# EasyEDA Pro project RS232转接控制板.eprj

# Schematic 原理图
Board Name: 转接隔离板; Create Date: 2024-04-22; Page Name: 主控MCU; Project Name: RS232转接控制板; Schematic Name: 原理图; Update Date: 2025-11-13; Company: 嘉立创EDA; Page Size: A3; Version: V1.0
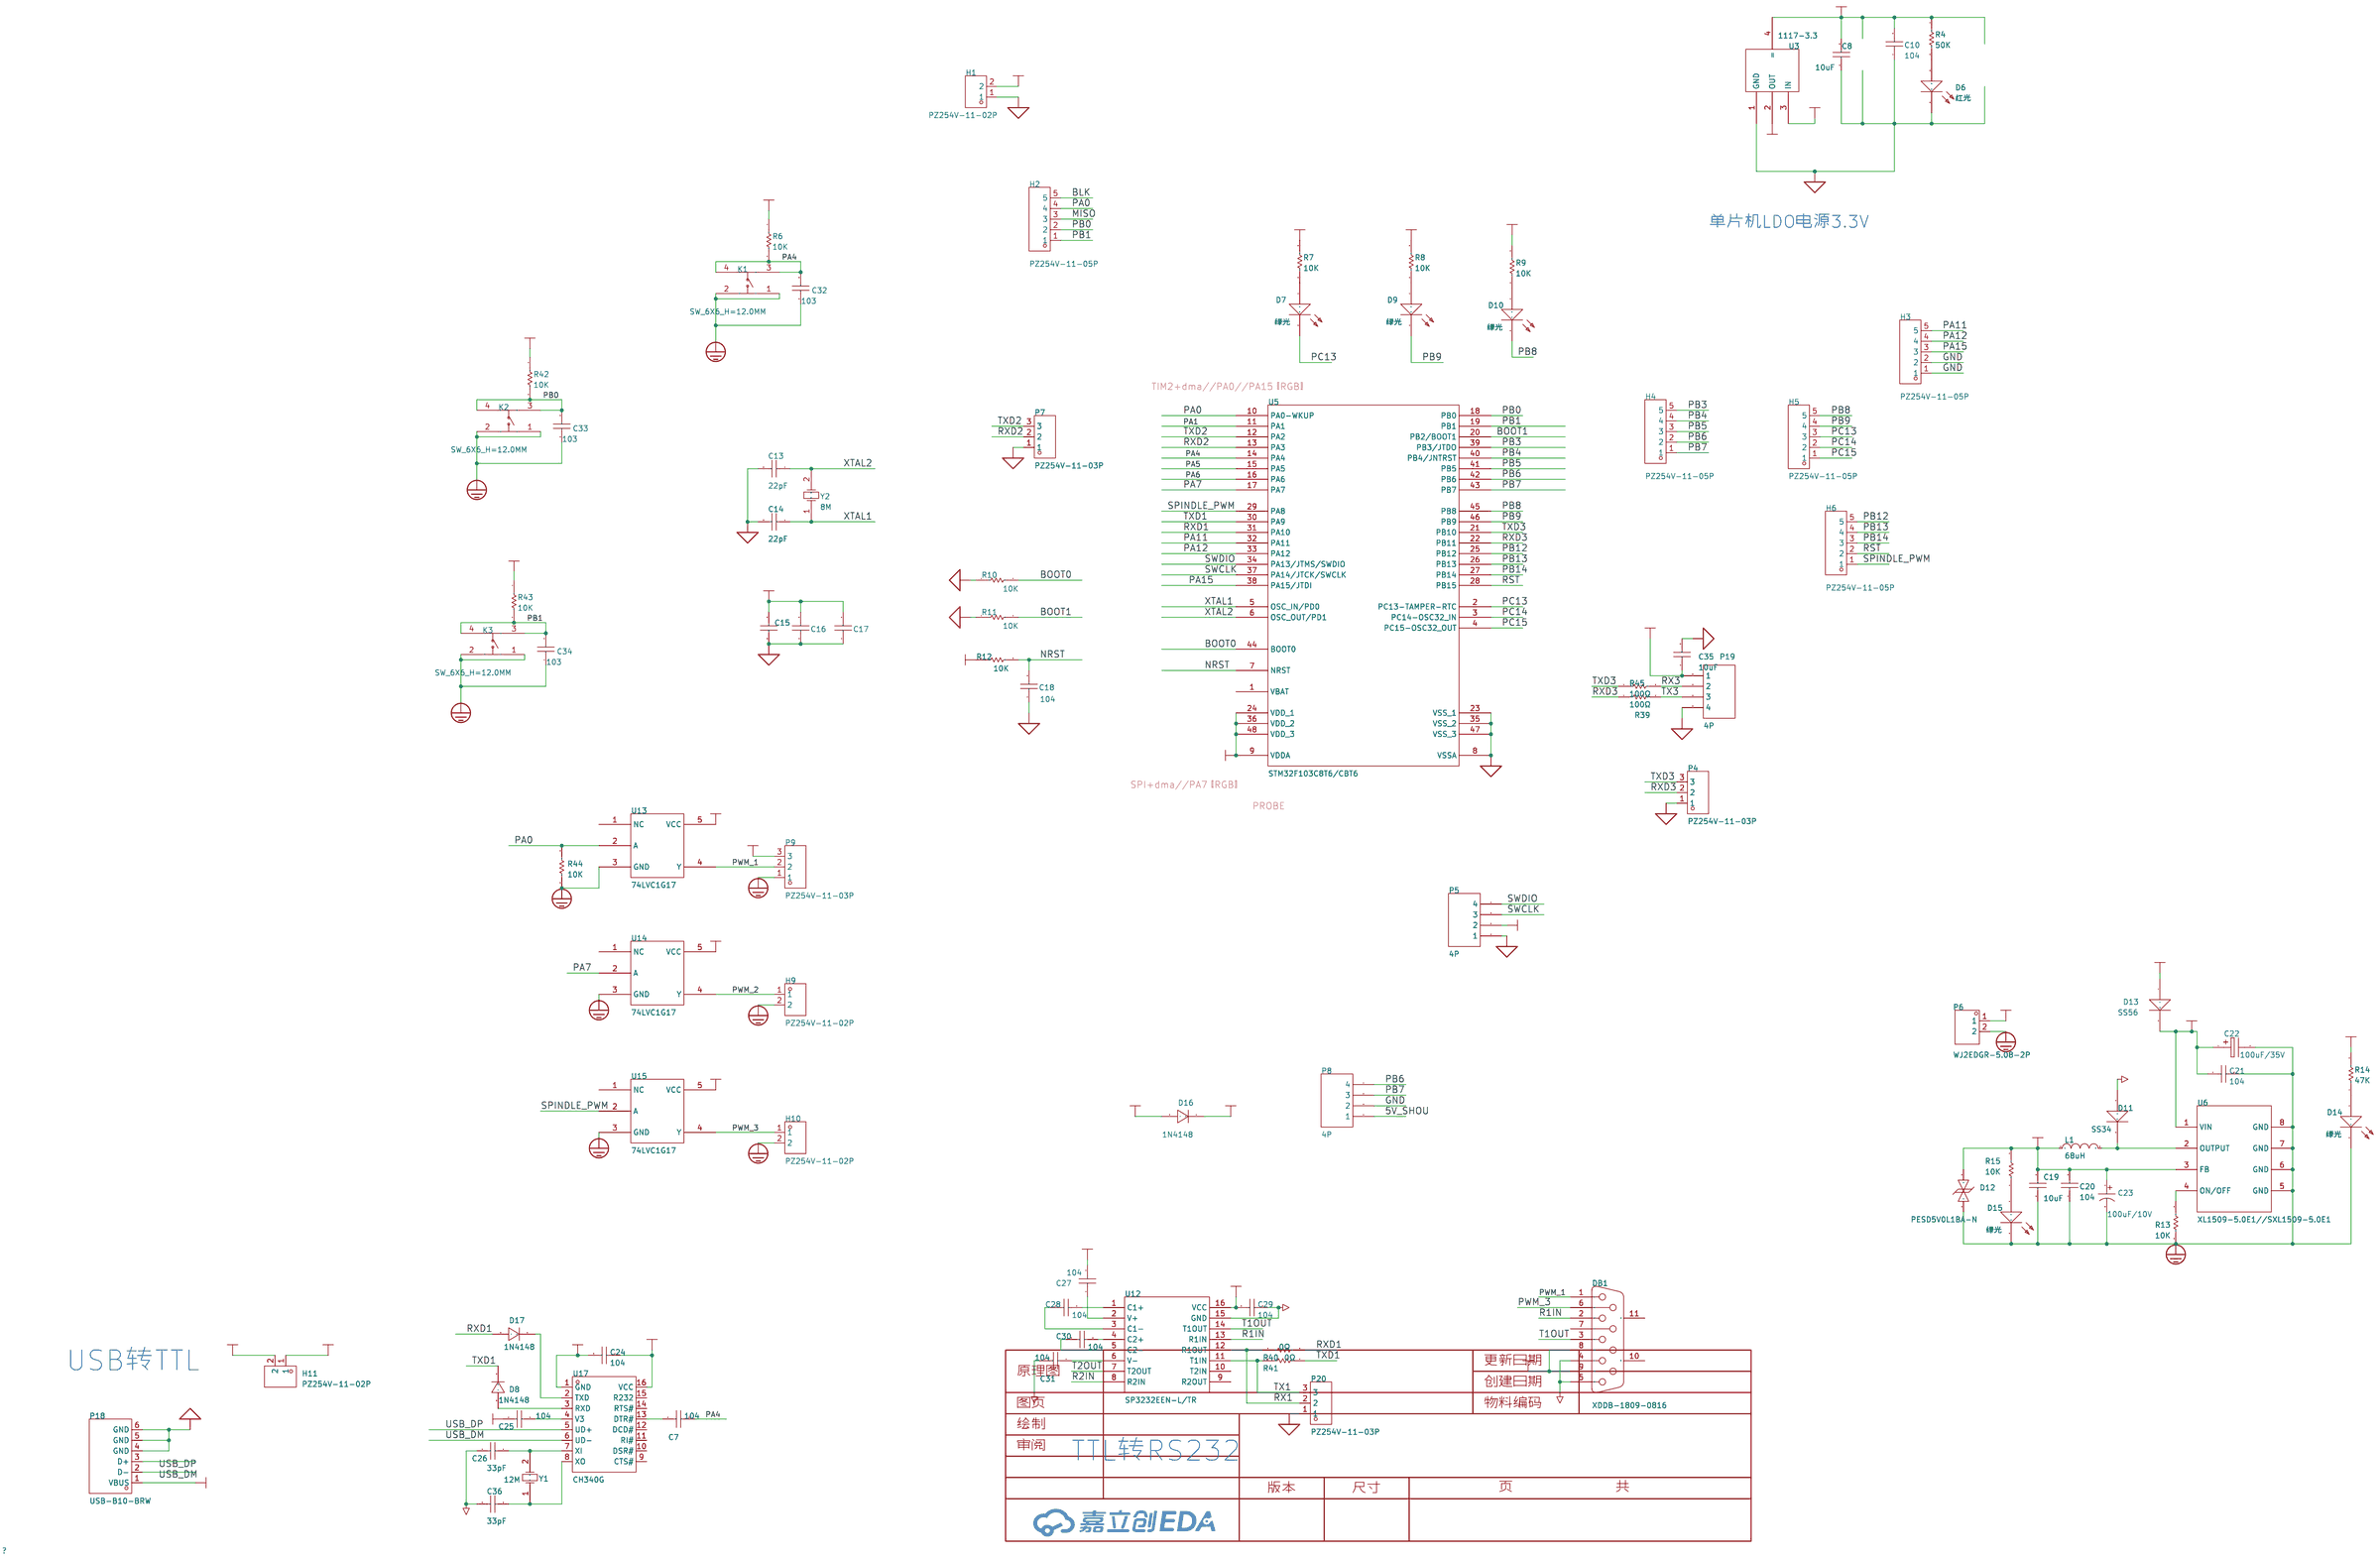
[diagram p0: schematic sheet]

## Parts
C7  104  [0603C]
C8  10uF  [C1206]
C10  104  [0603C]
C13  100pF  [0603C]
C14  100pF  [0603C]
C15  104  [0603C]
C16  104  [0603C]
C17  104  [0603C]
C18  104  [0603C]
C19  10uF  [C1206]
C20  104  [0603C]
C21  104  [0603C]
C22  100uF/35V  [电解电容贴片6X6]
C23  100uF/10V  [CAP-SMD_BD5.0-L5.3-W5.3-RD]
C24  104  [0603C]
C25  104  [0603C]
C26  18pF  [0603C]
C27  104  [0603C]
C28  104  [0603C]
C29  104  [0603C]
C30  104  [0603C]
C31  104  [0603C]
C32  103  [11]
C33  103  [11]
C34  103  [11]
C35  10uF  [C1206]
C36  18pF  [0603C]
D6  红光  [0603LED]
D7  绿光  [0603LED]
D8  1N4148  [SOD-123_L2.8-W1.8-LS3.7-RD]
D9  绿光  [0603LED]
D10  绿光  [0603LED]
D11  SS34  [SMA]
D12  PESD5V0L1BA-N  [SOD-323_L1.8-W1.3-LS2.5-BI]
D13  SS56  [SMA]
D14  绿光  [0603LED]
D15  绿光  [0603LED]
D16  1N4148  [SOD-123_L2.8-W1.8-LS3.7-RD]
D17  1N4148  [SOD-123_L2.8-W1.8-LS3.7-RD]
DB1  XDDB-1809-0816  [DB9-TH_LD09P33E4GV00LF]
H1  PZ254V-11-02P  [HDR-TH_2P-P2.54-V-M]
H2  PZ254V-11-05P  [HDR-TH_5P-P2.54-V-M]
H3  PZ254V-11-05P  [HDR-TH_5P-P2.54-V-M]
H4  PZ254V-11-05P  [HDR-TH_5P-P2.54-V-M]
H5  PZ254V-11-05P  [HDR-TH_5P-P2.54-V-M]
H6  PZ254V-11-05P  [HDR-TH_5P-P2.54-V-M]
H9  PZ254V-11-02P  [HDR-TH_2P-P2.54-V-M]
H10  PZ254V-11-02P  [HDR-TH_2P-P2.54-V-M]
H11  PZ254V-11-02P  [HDR-TH_2P-P2.54-V-M]
K1  SW_6X6_H=12.0MM  [KEY-SMD_4P-L6.0-W6.0-P4.50-LS9.0]
K2  SW_6X6_H=12.0MM  [KEY-SMD_4P-L6.0-W6.0-P4.50-LS9.0]
K3  SW_6X6_H=12.0MM  [KEY-SMD_4P-L6.0-W6.0-P4.50-LS9.0]
L1  68uH  [IND-SMD_L7.0-W7.0_SMDRI74-330MT]
P4  PZ254V-11-03P  [HDR-TH_3P-P2.54-V-M]
P5  4P  [SIP4]
P6  WJ2EDGR-5.08-2P  [CONN-TH_WJ2EDGR-5.08-2P]
P7  PZ254V-11-03P  [HDR-TH_3P-P2.54-V-M]
P8  4P  [SIP4]
P9  PZ254V-11-03P  [HDR-TH_3P-P2.54-V-M]
P18  USB-B10-BRW  [USB-B-TH_USB-B10-BRW]
P19  4P  [HDR1X4_CON]
P20  PZ254V-11-03P  [HDR-TH_3P-P2.54-V-M]
R4  50K  [0603R]
R6  10K  [0603R]
R7  10K  [0603R]
R8  10K  [0603R]
R9  10K  [0603R]
R10  10K  [0603R]
R11  10K  [0603R]
R12  10K  [0603R]
R13  10K  [0603R]
R14  47K  [0603R]
R15  10K  [0603R]
R39  100Ω  [0603R]
R40  0Ω  [0603R]
R41  0Ω  [0603R]
R42  10K  [0603R]
R43  10K  [0603R]
R44  10K  [0603R]
R45  100Ω  [0603R]
U3  1117-3.3  [SOT-223]
U5  STM32F103C8T6/CBT6  [LQFP48]
U6  XL1509-5.0E1//SXL1509-5.0E1  [ESOP-8_L4.9-W3.9-P1.27-LS6.0-BL-EP]
U12  SP3232EEN-L/TR  [SOIC-16_L9.9-W3.9-P1.27-LS6.0-BL]
U13  74LVC1G17  [SOT-23-5]
U14  74LVC1G17  [SOT-23-5]
U15  74LVC1G17  [SOT-23-5]
U17  CH340G  [SOIC-16_L9.9-W3.9-P1.27-LS6.0-BL]
Y1  12M  [晶振贴片49SSMD]
Y2  8M  [晶振贴片]

## Library data of the parts
C7 C18 C25 = 104: Capacitor (Semiconductor SIM Model); Published: 8-Jun-2000; LatestRevisionDate: 17-Jul-2002; LatestRevisionNote: Re-released for DXP Platform.; PackageReference: C1206; Publisher: Altium Limited; Origin Footprint 2: C1206; Origin Footprint 3: 0402; Origin Footprint 4: 1310[0504]; Origin Footprint 5: 1608[0603]; Origin Footprint 6: C1210; Origin Footprint 7: C0805; Origin Footprint 8: C1206; Origin Footprint 9: 0805; Origin Footprint 10: 0805L; Origin Footprint 11: 0805C; Design Item ID: Cap Semi; Library Name: Miscellaneous Devices
C8 C19 C35 = 104: Design Item ID: CAP; Library Name: SCH--װ--
C10 C20 C21 = 104: Capacitor (Semiconductor SIM Model); Published: 8-Jun-2000; LatestRevisionDate: 17-Jul-2002; LatestRevisionNote: Re-released for DXP Platform.; PackageReference: C1206; Publisher: Altium Limited; Origin Footprint 2: C1206; Origin Footprint 3: 0402; Origin Footprint 4: 1310[0504]; Origin Footprint 5: 1608[0603]; Origin Footprint 6: C1210; Origin Footprint 7: C0805; Origin Footprint 8: C1206; Origin Footprint 9: 0805; Origin Footprint 10: 0805L; Design Item ID: Cap Semi; Library Name: Miscellaneous Devices
C13 C14 = 22pF: Capacitor (Semiconductor SIM Model); Published: 8-Jun-2000; LatestRevisionDate: 17-Jul-2002; LatestRevisionNote: Re-released for DXP Platform.; PackageReference: C1206; Publisher: Altium Limited; Origin Footprint 2: C1206; Origin Footprint 3: 0402; Origin Footprint 4: 1310[0504]; Origin Footprint 5: 1608[0603]; Origin Footprint 6: C1210; Origin Footprint 7: C0805; Origin Footprint 8: C1206; Origin Footprint 9: 0805; Origin Footprint 10: 0805L; Origin Footprint 11: 0805C; Design Item ID: Cap Semi; Library Name: Miscellaneous Devices
C15-C17 = 104: Origin Footprint 2: CAP; Origin Footprint 3: 0805C; Design Item ID: CAP; Library Name: SCH封装库
C22 = 100uF/35V: Origin Footprint 2: X47U; Origin Footprint 1: 电解电容贴片6x6; Design Item ID: ELECTRO1; Library Name: *
C23 = CS1A101M-CRD54: 容值:100uF;精度:±20%;额定电压:10V;电容体直径:5mm;电容体长度:5.4mm;纹波电流:-;等效串联电阻:-;工作寿命:1000hrs@105℃;工作温度:-40℃~+105℃;; LCSC Part Name: 100uF ±20% 10V; Supplier Part: C96182; Manufacturer: ST(先科); Supplier Footprint: SMD,5x5.4mm; JLCPCB Part Class: Extended Part; Datasheet: https://atta.szlcsc.com/upload/public/pdf/source/20170304/1488621207726.pdf; Supplier: LCSC; Tolerance: ±20%; Rated Voltage: 10V; φD: 5mm; L: 5.4mm; Lifetime @ Temp: 1000hrs@105℃; Operating Temperature: -40℃~+105℃
C24 C27-C31 = 103: Capacitor (Semiconductor SIM Model); Published: 8-Jun-2000; LatestRevisionDate: 17-Jul-2002; LatestRevisionNote: Re-released for DXP Platform.; PackageReference: C1206; Publisher: Altium Limited; Origin Footprint 2: C1206; Origin Footprint 3: 0402; Origin Footprint 4: 1310[0504]; Origin Footprint 5: 1608[0603]; Origin Footprint 6: C1210; Origin Footprint 7: C0805; Origin Footprint 8: C1206; Origin Footprint 9: 0805; Origin Footprint 10: 0805L; Design Item ID: Cap Semi; Library Name: Miscellaneous Devices
C26 C36 = 33pF: Capacitor (Semiconductor SIM Model); Published: 8-Jun-2000; LatestRevisionDate: 17-Jul-2002; LatestRevisionNote: Re-released for DXP Platform.; PackageReference: C1206; Publisher: Altium Limited; Origin Footprint 2: C1206; Origin Footprint 3: 0402; Origin Footprint 4: 1310[0504]; Origin Footprint 5: 1608[0603]; Origin Footprint 6: C1210; Origin Footprint 7: C0805; Origin Footprint 8: C1206; Origin Footprint 9: 0805; Origin Footprint 10: 0805L; Design Item ID: Cap Semi; Library Name: Miscellaneous Devices
C32-C34 = 103: Design Item ID: CAP; Library Name: SCH封装库
D6 = 红光: Origin Footprint 2: LED(小); Design Item ID: LED; Library Name: SCH封装库
D7 D9 D10 D14 D15 = 绿光: Origin Footprint 2: LED(小); Design Item ID: LED; Library Name: SCH封装库
D8 D16 D17 = 1N4148W-TP: 二极管配置:-;功率:400mW;直流反向耐压(Vr):100V;平均整流电流(Io):150mA;正向压降(Vf):1.25V@150mA;反向电流(Ir):1μA@75V;反向恢复时间(trr):4ns;工作温度:-65℃~+150℃@(Tj);; LCSC Part Name: 100V 150mA 4ns; Supplier Part: C77978; Manufacturer: MCC(美微科); Supplier Footprint: SOD-123; JLCPCB Part Class: Extended Part; Datasheet: https://atta.szlcsc.com/upload/public/pdf/source/20161112/1478931639357.pdf; Supplier: LCSC; Power Dissipation: 400mW; Reverse Voltage (Vr): 100V; Average Rectified Current (Io): 150mA; Forward Voltage (Vf@If): 1.25V@150mA; Reverse Leakage Current: 1μA@75V; Reverse Recovery Time (trr): 4ns; Operating Temperature: -65℃~+150℃@(Tj)
D11 = SS56: Design Item ID: 1N4148; Library Name: SCH--װ--
D12 = PESD5V0S1BBN: 极性:Bidirectional;反向关断电压（典型值）:5V (Max);击穿电压（最小值）:6V;箝位电压:15V;峰值脉冲电流（10/1000us）:5A (8/20us);; Supplier Part: C314264; Manufacturer: BORN伯恩半导体; Supplier Footprint: SOD-523; JLCPCB Part Class: Extended Part; Datasheet: https://atta.szlcsc.com/upload/public/pdf/source/20181015/C314264_F9AC5761AC2631DA841FBD1D9C6821E3.pdf; Supplier: LCSC; Polarity: Bidirectional; Voltage - Reverse Standoff (Typ): 5V (Max); Voltage - Breakdown (Min): 6V; Voltage - Clamping (Max) @ Ipp: 15V; Current - Peak Pulse (10/1000μs): 5A (8/20us)
D13 = SS56: Design Item ID: 1N4148; Library Name: SCH封装库
DB1 = XDDB-1809-0816: 连接器类型:常规D-Sub;公母:公;总PIN位数:9P;安装方式:弯插;排数:2;额定电流-信号脚:3A;工作温度范围:-40℃~+85℃;; LCSC Part Name: D-Sub 公 P数:9P; Supplier Part: C7498157; Manufacturer: LX(连欣科技); Supplier Footprint: 插件; JLCPCB Part Class: 扩展库; Datasheet: https://atta.szlcsc.com/upload/public/pdf/source/20230825/11AC0D8BC28315CABA4F65E63009CD5C.pdf; Supplier: LCSC; Connector Type: 常规D-Sub; Gender: 公; Number of Pins: 9P; Mounting Style: 弯插; Number of Rows: 2; Current Rating-Signal (Max): 3A; Rated Voltage (Max): 100V; Operating Temperature Range: -40℃~+85℃
H1 H9-H11 = PZ254V-11-02P: 插针结构:1x2P;间距:2.54mm;行距:-;圆针/方针:方针;安装类型:直插;排数:单排;总PIN位数:2P;额定电流:-;额定电压:-;配合针长度:6mm;塑高:2.5mm;端接针长度:3mm;触头材质:黄铜;触头镀层:-;工作温度范围:-40℃~+105℃;颜色:黑色;; LCSC Part Name: 间距:2.54mm 1x2P 直插 方针; Supplier Part: C492401; Manufacturer: XFCN(兴飞); Supplier Footprint: 插件,P=2.54mm; JLCPCB Part Class: 扩展库; Datasheet: https://atta.szlcsc.com/upload/public/pdf/source/20200309/C492401_A812433581A9B211A7FFA413ADDFF0E5.pdf; Supplier: LCSC; Pin Structure: 1x2P; Pitch: 2.54mm; Circluar Pins/Square Pins: 方针; Mounting Type: 直插; Number of Rows: 单排; Number of Pins: 2P; Length of Mating Pin: 6mm; Insulation Height: 2.5mm; Length of End Connection Pin: 3mm; Contact Material: 黄铜; Operating Temperature Range: -40℃~+105℃; Color: 黑色
H2-H6 = PZ254V-11-05P: LCSC Part Name: 2.54mm 1x5P 直插 方针; Supplier Part: C492404; Manufacturer: XFCN(兴飞); Supplier Footprint: 直插,P=2.54mm; JLCPCB Part Class: Extended Part; Datasheet: https://atta.szlcsc.com/upload/public/pdf/source/20200309/C492404_E51533260F8710EFF5D4617281164C1D.pdf; Supplier: LCSC; Pitch: 2.54mm; Number of Pins: 5; Number of Rows: 1; Pin Structure: 1x5P; Mounting Type: 直插; Circluar Pins/Square Pins: 方针; Length of Mating Pin: 6mm; Insulation Height: 2.5mm; Length of End Connection Pin: 3mm; Contact Material: 黄铜; Operating Temperature Range: -40℃~+105℃; Color: 黑色
K1-K3 = SW_6X6_H=12.0MM: Supplier Part: C9900018802; Supplier Footprint: KEY-SMD; JLCPCB Part Class: 扩展库; Supplier: LCSC
L1 = SMDRI74-330MT: 电感值:33uH;精度:±20%;额定电流:960mA;饱和电流(Isat):1.8A;类型:屏蔽电感;; LCSC Part Name: 33uH±20%1.8A; Supplier Part: C49625; Manufacturer: SXN(顺翔诺); Supplier Footprint: SMD,7.5x7.5mm; JLCPCB Part Class: 扩展库; Datasheet: https://atta.szlcsc.com/upload/public/pdf/source/20210810/6F96FDC19AA308DD2AD166FFB9640E87.pdf; Supplier: LCSC; Tolerance: ±20%; Rated Current: 960mA; Saturation Current (Isat): 1.8A; DC Resistance (DCR): 170mΩ; Type: 屏蔽电感
P4 P7 P9 P20 = PZ254V-11-03P: 插针结构:1x3P;间距:2.54mm;行距:-;圆针/方针:方针;安装类型:直插;排数:单排;总PIN位数:3P;额定电流:3A;额定电压:250V;配合针长度:6mm;塑高:2.5mm;端接针长度:3mm;工作温度范围:-40℃~+105℃;颜色:黑色;; LCSC Part Name: 间距:2.54mm 1x3P 直插 方针; Supplier Part: C2937625; Manufacturer: XFCN(兴飞); Supplier Footprint: 插件,P=2.54mm; JLCPCB Part Class: 扩展库; Datasheet: https://atta.szlcsc.com/upload/public/pdf/source/20200309/C492402_8335C3D49C4E4C618838D59BB1D024C1.pdf; Supplier: LCSC; Pin Structure: 1x3P; Pitch: 2.54mm; Circluar Pins/Square Pins: 方针; Mounting Type: 直插; Number of Rows: 单排; Number of Pins: 3P; Current Rating (Max): 3A; Voltage Rating (Max): 250V; Length of Mating Pin: 6mm; Insulation Height: 2.5mm; Length of End Connection Pin: 3mm; Operating Temperature Range: -40℃~+105℃; Color: 黑色
P5 P8 = 4P: Library Name: SCH--װ--
P6 = WJ2EDGR-5.08-2P: 每排PIN数:2;安装方式:弯针;排数:1;间距:5.08mm;连接器类型:板端/插座-开口;; LCSC Part Name: 插针/板端 弯针 2P 5.08mm; Supplier Part: C8383; Manufacturer: KANGNEX(康奈克斯电气); Supplier Footprint: P=5.08mm; JLCPCB Part Class: Extended Part; Datasheet: https://atta.szlcsc.com/upload/public/pdf/source/20191225/C8383_DE80ABD4B75356B45B295FA186A21D08.pdf; Supplier: LCSC; Number of PINs Per Row: 2; Mounting Sytle: 弯针; Number of Rows: 1; Pitch: 5.08mm; Connector Type: 板端/插座-开口
P18 = USB-B10-BRW: 连接器类型:Type-B;标准:USB 2.0;公母:母;端口数量:1;触点数量:4P;安装方式:弯插;额定电流 - 电源:1.5A;工作温度范围:-20℃~+70℃;焊接温度(最大值):260℃;; LCSC Part Name: Type-B母弯插; Supplier Part: C720549; Manufacturer: XUNPU(讯普); Supplier Footprint: 插件; JLCPCB Part Class: 扩展库; Datasheet: https://atta.szlcsc.com/upload/public/pdf/source/20200812/C720549_53E9294752E2933874870440E626C579.pdf; Supplier: LCSC; Connector Type: Type-B; Standard: USB2.0; Gender: 母; Number of Ports: 1; Number of Contacts: 4P; Mounting Style: 弯插; Current Rating - Power (Max): 1.5A; Operating Temperature Range: -20℃~+70℃; Soldering Temperature(Max): 260℃
P19 = 4P: Library Name: SCH封装库
R4 R7-R9 R14 = 1K: Resistor; Published: 8-Jun-2000; LatestRevisionDate: 17-Jul-2002; LatestRevisionNote: Re-released for DXP Platform.; PackageReference: AXIAL-0.3; Publisher: Altium Limited; Origin Footprint 2: AXIAL-0.3; Origin Footprint 3: R0805; Origin Footprint 4: 0805R; Design Item ID: RES; Library Name: SCH封装库
R6 R15 R42 R43 = 10K: Resistor; Published: 8-Jun-2000; LatestRevisionDate: 17-Jul-2002; LatestRevisionNote: Re-released for DXP Platform.; PackageReference: AXIAL-0.3; Publisher: Altium Limited; Origin Footprint 2: AXIAL-0.3; Origin Footprint 3: R0805; Origin Footprint 4: 0805R; Design Item ID: RES; Library Name: SCH封装库
R10-R12 R44 = 10K: Resistor; Published: 8-Jun-2000; LatestRevisionDate: 17-Jul-2002; LatestRevisionNote: Re-released for DXP Platform.; PackageReference: AXIAL-0.3; Publisher: Altium Limited; Origin Footprint 2: AXIAL-0.3; Origin Footprint 3: 0805R; Origin Footprint 4: 0805R; Design Item ID: RES; Library Name: SCH封装库
R13 = 10k: Resistor; Published: 8-Jun-2000; LatestRevisionDate: 17-Jul-2002; LatestRevisionNote: Re-released for DXP Platform.; PackageReference: AXIAL-0.3; Publisher: Altium Limited; Origin Footprint 2: AXIAL-0.3; Origin Footprint 3: R0805; Origin Footprint 4: 0805R; Design Item ID: RES; Library Name: SCH封装库
R39 R45 = 100: Resistor; Published: 8-Jun-2000; LatestRevisionDate: 17-Jul-2002; LatestRevisionNote: Re-released for DXP Platform.; PackageReference: AXIAL-0.3; Publisher: Altium Limited; Origin Footprint 2: AXIAL-0.3; Origin Footprint 3: R0805; Origin Footprint 4: 0805R; Design Item ID: RES; Library Name: SCH--װ--
R40 R41 = 100: Resistor; Published: 8-Jun-2000; LatestRevisionDate: 17-Jul-2002; LatestRevisionNote: Re-released for DXP Platform.; PackageReference: AXIAL-0.3; Publisher: Altium Limited; Origin Footprint 2: AXIAL-0.3; Origin Footprint 3: R0805; Origin Footprint 4: 0805R; Design Item ID: RES; Library Name: SCH封装库
U3 = 1117-3.3: Design Item ID: LM1117; Library Name: Party600
U5 = STM32F103C8T6/CBT6: STM32 ARM-based 32-bit MCU with 32 Kbytes Flash, 48-pin LQFP, Industrial Temperature; Published: *; DatasheetVersion: *; PackageVersion: *; PackageReference: *; Publisher: *; PackageDescription: *; ComponentLink1Description: *; ComponentLink1URL: *; ComponentLink2Description: *; ComponentLink2URL: *; Origin Footprint 2: LQFP48_L; Origin Footprint 3: LQFP48_M; Design Item ID: STM32F103C6T6; Library Name: ST Microcontroller 32-Bit STM32 SCH
U6 = XL1509-5.0E1: 功能类型:降压型;同步整流:-;输出通道数:-;拓扑结构:-;输入电压:-;输出电流(最大值):-;开关频率:-;; LCSC Part Name: 降压型; Supplier Part: C61063; Manufacturer: XLSEMI(芯龙); Supplier Footprint: SOP-8_150mil; JLCPCB Part Class: Basic Part; Datasheet: https://atta.szlcsc.com/upload/public/pdf/source/20151020/1457707483545.pdf; Supplier: LCSC; Function: 降压型
U12 = SP3232EEN-L/TR: 类型:收发器;数据速率:235Kbps;; LCSC Part Name: True3.0V至5.5V RS-232收发器; Supplier Part: C9378; Manufacturer: MaxLinear(迈凌); Supplier Footprint: SOIC-16; JLCPCB Part Class: 扩展库; Datasheet: https://item.szlcsc.com/datasheet/SP3232EEN-L%252FTR/9907.html; Supplier: LCSC; Type: 收发器; Number of Drivers: 2; Number of Receivers: 2; Data Rate: 235Kbps; Voltage - Supply: 3V~5.5V; Operating Temperature: -40℃~+85℃
U13-U15 = 74LVC1G04: Library Name: SCH--װ--
U17 = CH340G: 应用功能:收发器;接口协议:USB 2.0;数据速率:2Mbps;; LCSC Part Name: USB转串口芯片 CH340; Supplier Part: C14267; Manufacturer: WCH(南京沁恒); Supplier Footprint: SOP-16; JLCPCB Part Class: 扩展库; Datasheet: https://atta.szlcsc.com/upload/public/pdf/source/20230530/6E401E9554E9F5311886CC8B3F89B62E.pdf; Supplier: LCSC; Applications Function: 收发器; Protocol: USB 2.0; Supply Voltage: 3.3V；5V; Data Rate: 2Mbps
Y1 = 12M: Crystal Oscillator; Published: 8-Jun-2000; LatestRevisionDate: 17-Jul-2002; LatestRevisionNote: Re-released for DXP Platform.; PackageReference: R38; Publisher: Altium Limited; Origin Footprint 2: R38; Origin Footprint 3: XTAL-49S; Design Item ID: XTAL; Library Name: Miscellaneous Devices
Y2 = 8M: Crystal Oscillator; Published: 8-Jun-2000; LatestRevisionDate: 17-Jul-2002; LatestRevisionNote: Re-released for DXP Platform.; PackageReference: R38; Publisher: Altium Limited; Origin Footprint 2: R38; Origin Footprint 3: XTAL-49S; Design Item ID: XTAL; Library Name: Miscellaneous Devices

## Nets
3V3: C8.2 C10.2 C15.2 C16.2 C17.2 P5.2 R4.1 R6.1 R7.2 R8.2 R9.2 R12.1 R42.1 R43.1 U3.2(OUT) U3.4(=) U5.9(VDDA) U5.24(VDD_1) U5.36(VDD_2) U5.48(VDD_3)
5V_SHOU: D16.1(c) P8.1
5V_VCC: C19.1 C20.2 C23.1 C24.1 C27.1 C29.2 C35.1 D12.2 D16.2(A) H1.2 H11.1 L1.1 P9.3 P19.1 R15.2 U3.3(IN) U6.3(FB) U12.16(VCC) U13.5(VCC) U14.5(VCC) U15.5(VCC) U17.16(VCC)
24V: D13.1 DB1.8 DB1.9 P6.1 R14.2
GND: C8.1 C10.1 C13.2 C14.2 C15.1 C16.1 C17.1 C18.1 C19.2 C20.1 C21.1 C22.2 C23.2 C24.2 C25.2 C26.2 C29.1 C31.2 C32.1 C33.1 C34.1 C35.2 C36.2 D6.2 D11.1 D12.1 D14.2 D15.2 DB1.4 DB1.5 H1.1 H3.1 H3.2 H9.2 H10.2 K1.1 K1.2 K2.1 K2.2 K3.1 K3.2 P4.1 P5.1 P6.2 P7.1 P8.2 P9.1 P18.4(GND) P18.5(GND) P18.6(GND) P19.4 P20.1 R10.1 R11.1 R13.2 R44.1 U3.1(GND) U5.8(VSSA) U5.23(VSS_1) U5.35(VSS_2) U5.47(VSS_3) U6.5(GND) U6.6(GND) U6.7(GND) U6.8(GND) U12.15(GND) U13.3(GND) U14.3(GND) U15.3(GND) U17.1(GND)
VIN_24V: C21.2 C22.1 D13.2 U6.1(VIN)
BLK: H2.5
BOOT0: R10.2 U5.44(BOOT0)
BOOT1: R11.2 U5.20(PB2/BOOT1)
MISO: H2.3
NRST: C18.2 R12.2 U5.7(NRST)
PA0: H2.4 R44.2 U5.10(PA0-WKUP) U13.2(A)
PA1: U5.11(PA1)
PA4: C7.2 C32.2 K1.3 K1.4 R6.2 U5.14(PA4)
PA5: U5.15(PA5)
PA6: U5.16(PA6)
PA7: U5.17(PA7) U14.2(A)
PA11: H3.5 U5.32(PA11)
PA12: H3.4 U5.33(PA12)
PA15: H3.3 U5.38(PA15/JTDI)
PB0: C33.2 H2.2 K2.3 K2.4 R42.2 U5.18(PB0)
PB1: C34.2 H2.1 K3.3 K3.4 R43.2 U5.19(PB1)
PB3: H4.5 U5.39(PB3/JTDO)
PB4: H4.4 U5.40(PB4/JNTRST)
PB5: H4.3 U5.41(PB5)
PB6: H4.2 P8.4 U5.42(PB6)
PB7: H4.1 P8.3 U5.43(PB7)
PB8: D10.2 H5.5 U5.45(PB8)
PB9: D9.2 H5.4 U5.46(PB9)
PB12: H6.5 U5.25(PB12)
PB13: H6.4 U5.26(PB13)
PB14: H6.3 U5.27(PB14)
PC13: D7.2 H5.3 U5.2(PC13-TAMPER-RTC)
PC14: H5.2 U5.3(PC14-OSC32_IN)
PC15: H5.1 U5.4(PC15-OSC32_OUT)
PWM_1: DB1.1 P9.2 U13.4(Y)
PWM_2: H9.1 U14.4(Y)
PWM_3: DB1.6 H10.1 U15.4(Y)
R1IN: DB1.2 U12.13(R1IN)
R2IN: U12.8(R2IN)
RST: H6.2 U5.28(PB15)
RX1: P20.2 R40.2 U12.12(R1OUT)
RX3: P19.2 R45.2
RXD1: D17.2(A) R40.1 U5.31(PA10)
RXD2: P7.2 U5.13(PA3)
RXD3: P4.2 R39.1 U5.22(PB11)
SPINDLE_PWM: H6.1 U5.29(PA8) U15.2(A)
SWCLK: P5.3 U5.37(PA14/JTCK/SWCLK)
SWDIO: P5.4 U5.34(PA13/JTMS/SWDIO)
T1OUT: DB1.3 U12.14(T1OUT)
T2OUT: U12.7(T2OUT)
TX1: P20.3 R41.2 U12.11(T1IN)
TX3: P19.3 R39.2
TXD1: D8.1(c) R41.1 U5.30(PA9)
TXD2: P7.3 U5.12(PA2)
TXD3: P4.3 R45.1 U5.21(PB10)
USB_DM: P18.2(D-) U17.6(UD-)
USB_DP: P18.3(D+) U17.5(UD+)
VUSB: H11.2 P18.1(VBUS)
XTAL1: C14.1 U5.5(OSC_IN/PD0) Y2.1(OSC1)
XTAL2: C13.1 U5.6(OSC_OUT/PD1) Y2.2(OSC2)
$1N53807: D10.1 R9.1
$1N55881: D6.1 R4.2
$1N62788: D7.1 R7.1
$1N65547: D9.1 R8.1
$1N74475: D11.2 L1.2 U6.2(OUTPUT)
$1N74477: R13.1 U6.4(ON/OFF)
$1N74482: D14.1 R14.1
$1N74484: D15.1 R15.1
$1N75028: C31.1 U12.6(V-)
$1N75031: C27.2 U12.2(V+)
$1N75032: C30.2 U12.4(C2+)
$1N75033: C30.1 U12.5(C2-)
$1N75034: C28.2 U12.1(C1+)
$1N75035: C28.1 U12.3(C1-)
$1N79605: C25.1 U17.4(V3)
$1N79615: C26.1 U17.7(XI) Y1.2(OSC2)
$1N79616: C36.1 U17.8(XO) Y1.1(OSC1)
$1N79631: D17.1(c) U17.2(TXD)
$1N79632: D8.2(A) U17.3(RXD)
$1N79737: C7.1 U17.13(DTR#)

Not connected (* = marked no-connect by the designer): DB1 7 10(MH1) 11(MH2); U5 1(VBAT); U12 9(R2OUT) 10(T2IN); U13 1(NC); U14 1(NC); U15 1(NC); U17 9(CTS#) 10(DSR#) 11(RI#) 12(DCD#) 14(RTS#) 15(R232)

## Notes on the sheet
- 单片机LDO电源3.3V
- TIM2+dma//PA0//PA15【RGB】
- SPI+dma//PA7【RGB】
- PROBE
- USB转TTL
- TTL转RS232

# Board PCB
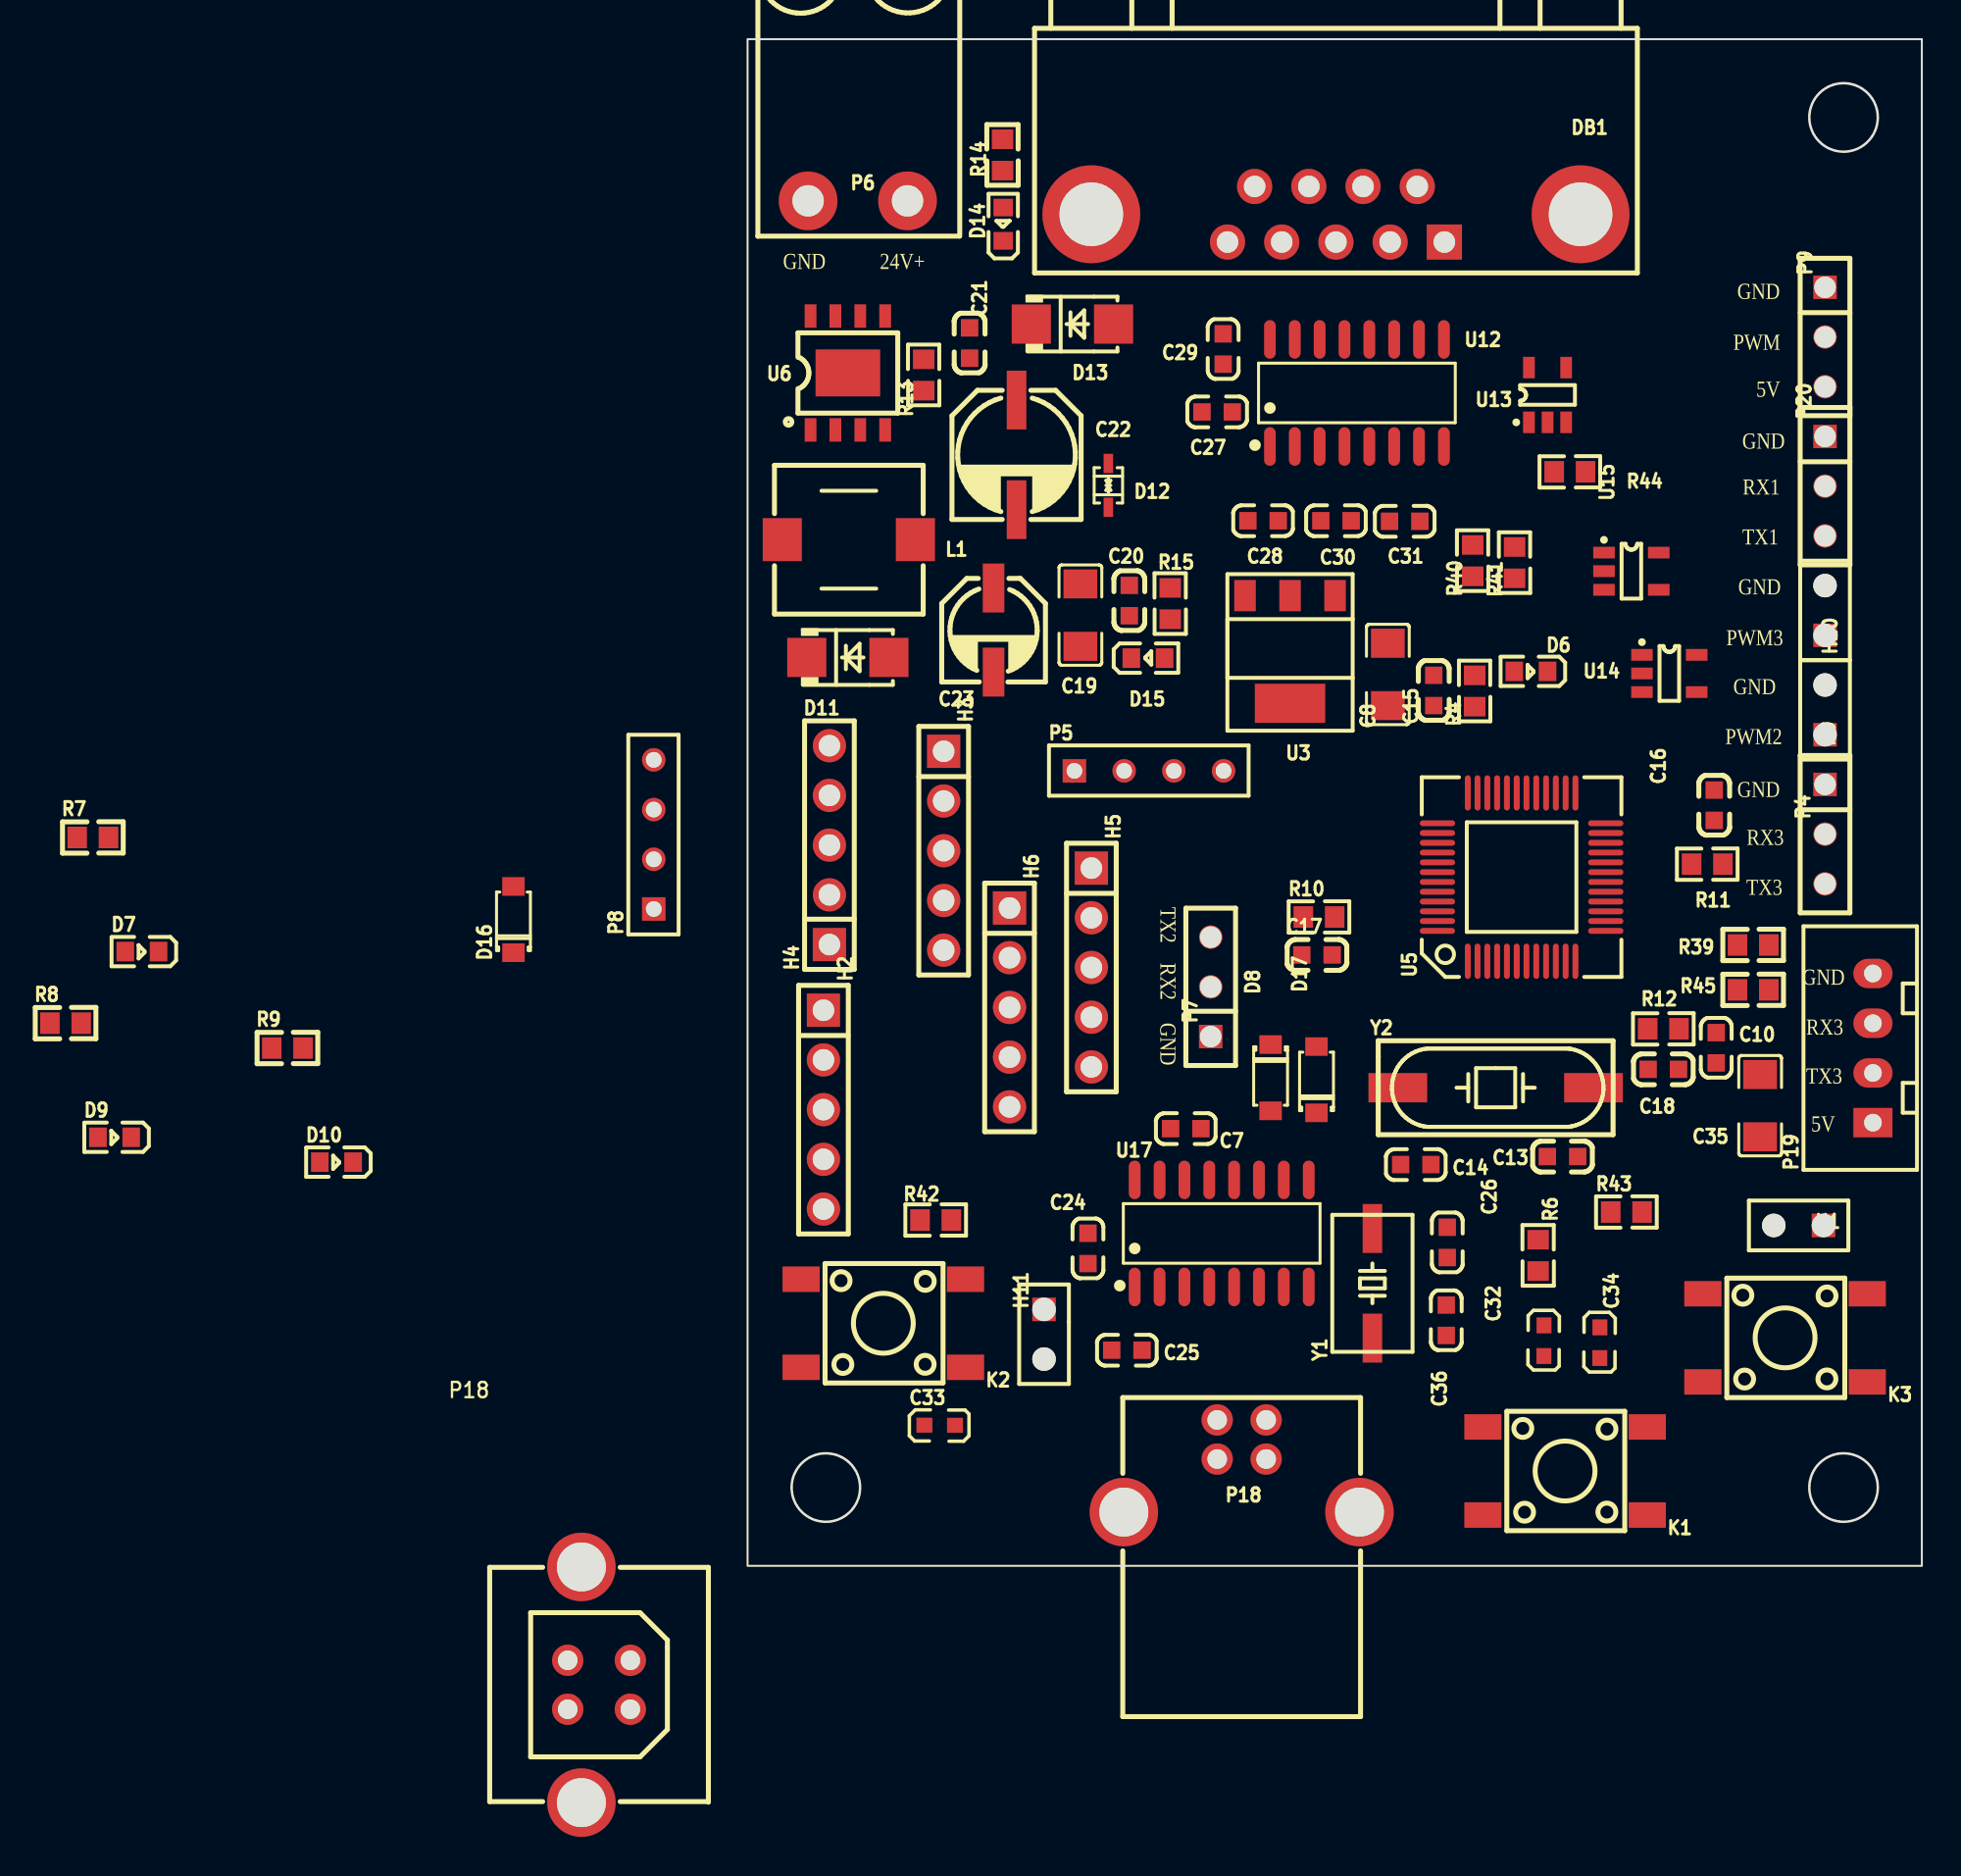
[diagram p1: board, top side]
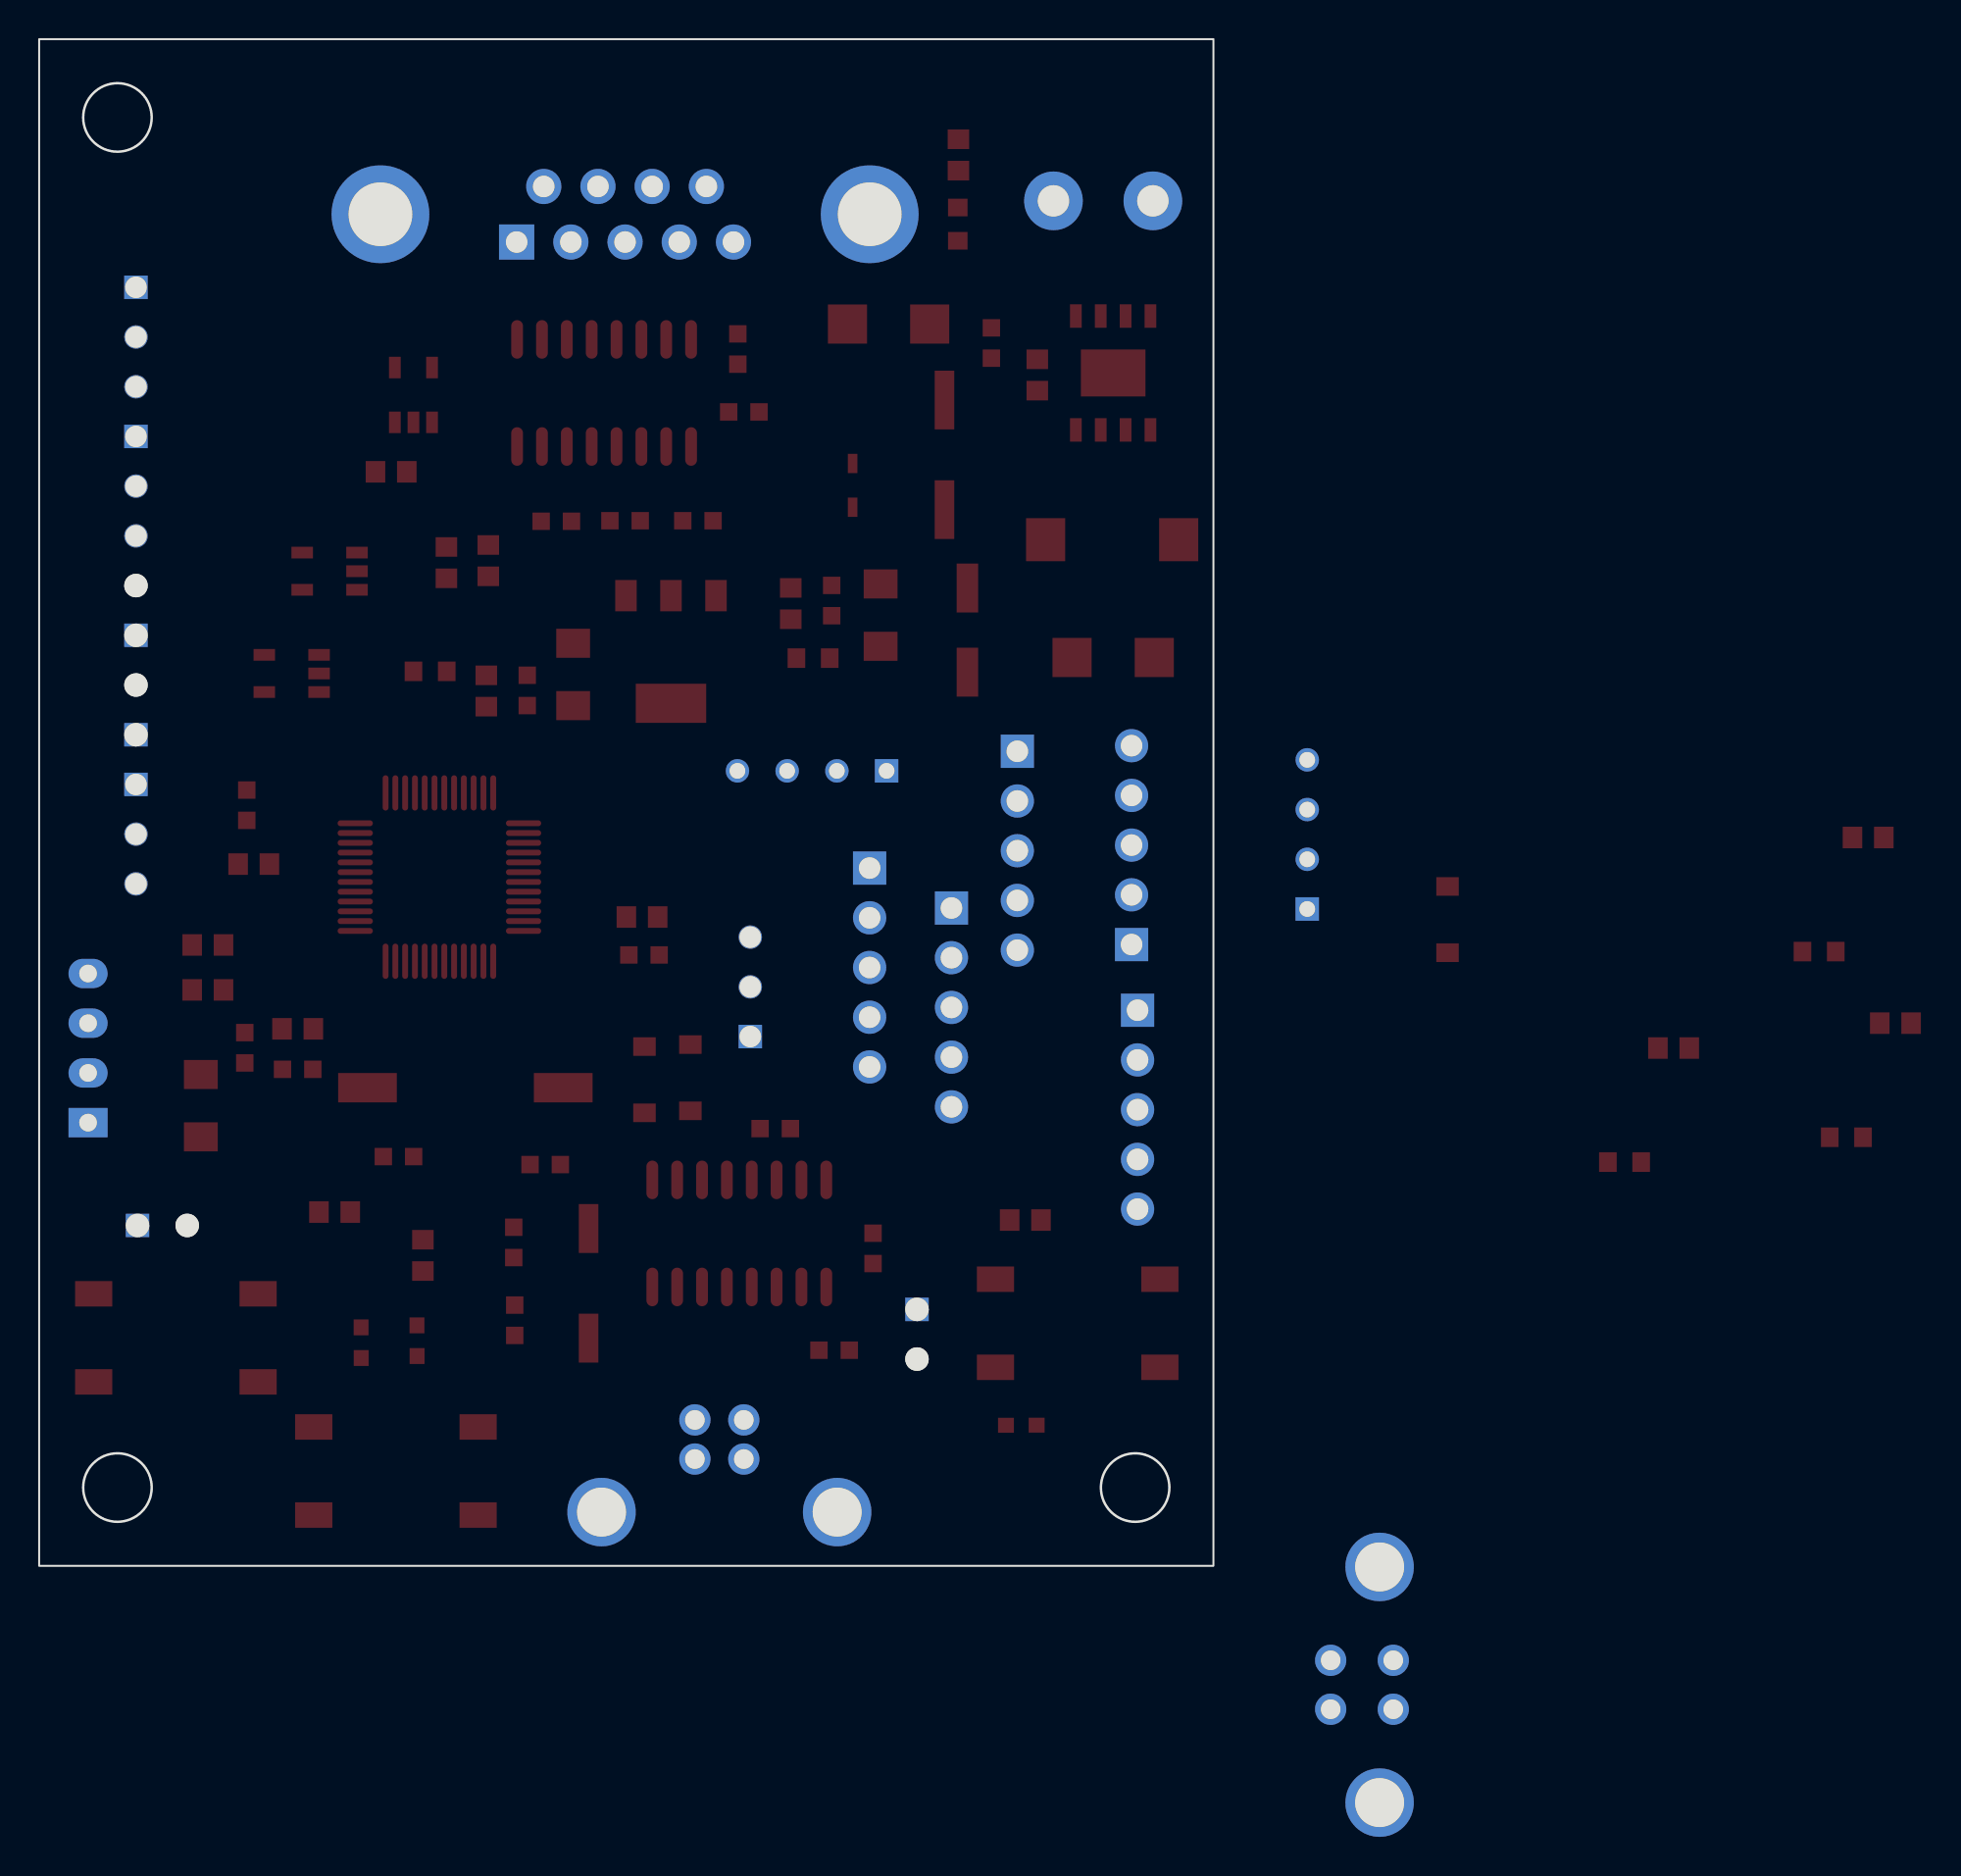
[diagram p2: board, bottom side, seen from below]

Outline 60 x 78 mm; copper layers: Top Layer, Bottom Layer. Coordinates in mm from the lower left corner of the outline.
Outline path: rectangle 0,78 60,0 ; circle c4,4 r1.75 ; circle c56,74 r1.75 ; circle c56,4 r1.75
Stack: Top Layer 0.035mm / Dielectric1 1.51mm FR4 er 4.5 / Bottom Layer 0.035mm

## Design rules (mm)
template: 用户自定义配置
spacing Default (default): track to track 0.152, other pairs 0 to 0.152
track width Default (default): min 0.254, default 0.254, max 25.4
differential pair differentialPair (default): width min 0.127, default 0.254, max 2.54; gap min 0.152, default 0.152
via Default (default): diameter min 0.25, default 0.61, max 100.025; hole min 0.2, default 0.305, max 59.995

## Placement (name value [footprint] x y rotation side)
C7  104  [0603C]  22.39 22.34 180 top
C8  10uF  [C1206]  32.72 45.54 270 top
C10  104  [0603C]  49.49 26.47 90 top
C13  100pF  [0603C]  41.64 20.91 180 top
C14  100pF  [0603C]  34.14 20.5 0 top
C15  104  [0603C]  35.06 44.73 270 top
C16  104  [0603C]  49.39 38.86 90 top
C17  104  [0603C]  29.09 31.21 0 top
C18  104  [0603C]  46.79 25.37 180 top
C19  10uF  [C1206]  17.01 48.57 270 top
C20  104  [0603C]  19.51 49.32 90 top
C21  104  [0603C]  11.35 62.47 270 top
C22  100uF/35V  [电解电容贴片6X6]  13.74 56.76 270 top
C23  100uF/10V  [CAP-SMD_BD5.0-L5.3-W5.3-RD]  12.57 47.81 90 top
C24  104  [0603C]  17.39 16.22 270 top
C25  104  [0603C]  19.38 11.02 180 top
C26  18pF  [0603C]  35.75 16.52 90 top
C27  104  [0603C]  23.99 58.96 0 top
C28  104  [0603C]  26.34 53.4 180 top
C29  104  [0603C]  24.3 62.17 270 top
C30  104  [0603C]  30.06 53.4 180 top
C31  104  [0603C]  33.58 53.37 180 top
C32  103  [11]  40.39 10.76 270 top
C33  103  [11]  10.56 6.89 0 top
C34  103  [11]  43.25 10.66 270 top
C35  10uF  [C1206]  51.74 23.51 90 top
C36  18pF  [0603C]  35.7 12.55 90 top
D6  红光  [0603LED]  40.06 45.72 0 top
D7  绿光  [0603LED]  -30.91 31.4 0 top
D8  1N4148  [SOD-123_L2.8-W1.8-LS3.7-RD]  26.72 24.94 270 top
D9  绿光  [0603LED]  -32.31 21.91 0 top
D10  绿光  [0603LED]  -20.97 20.64 0 top
D11  SS34  [SMA]  5.12 46.41 0 top
D12  PESD5V0L1BA-N  [SOD-323_L1.8-W1.3-LS2.5-BI]  18.43 55.2 270 top
D13  SS56  [SMA]  16.6 63.44 0 top
D14  绿光  [0603LED]  13.08 68.51 270 top
D15  绿光  [0603LED]  20.42 46.36 180 top
D16  1N4148  [SOD-123_L2.8-W1.8-LS3.7-RD]  -11.96 33.02 90 top
D17  1N4148  [SOD-123_L2.8-W1.8-LS3.7-RD]  29.07 24.84 90 top
DB1  XDDB-1809-0816  [DB9-TH_LD09P33E4GV00LF]  30.06 69.05 180 top
H1  PZ254V-11-02P  [HDR-TH_2P-P2.54-V-M]  53.7 17.39 180 top
H2  PZ254V-11-05P  [HDR-TH_5P-P2.54-V-M]  3.88 23.31 270 top
H3  PZ254V-11-05P  [HDR-TH_5P-P2.54-V-M]  10.02 36.54 270 top
H4  PZ254V-11-05P  [HDR-TH_5P-P2.54-V-M]  4.18 36.82 90 top
H5  PZ254V-11-05P  [HDR-TH_5P-P2.54-V-M]  17.57 30.57 270 top
H6  PZ254V-11-05P  [HDR-TH_5P-P2.54-V-M]  13.39 28.53 270 top
H9  PZ254V-11-02P  [HDR-TH_2P-P2.54-V-M]  55.05 43.73 90 top
H10  PZ254V-11-02P  [HDR-TH_2P-P2.54-V-M]  55.05 48.81 90 top
H11  PZ254V-11-02P  [HDR-TH_2P-P2.54-V-M]  15.15 11.83 270 top
K1  SW_6X6_H=12.0MM  [KEY-SMD_4P-L6.0-W6.0-P4.50-LS9.0]  41.77 4.85 180 top
K2  SW_6X6_H=12.0MM  [KEY-SMD_4P-L6.0-W6.0-P4.50-LS9.0]  6.94 12.39 180 top
K3  SW_6X6_H=12.0MM  [KEY-SMD_4P-L6.0-W6.0-P4.50-LS9.0]  53.01 11.65 180 top
L1  68uH  [IND-SMD_L7.0-W7.0_SMDRI74-330MT]  5.17 52.43 180 top
P4  PZ254V-11-03P  [HDR-TH_3P-P2.54-V-M]  55.05 37.38 270 top
P5  4P  [SIP4]  16.7 40.62 0 top
P6  WJ2EDGR-5.08-2P  [CONN-TH_WJ2EDGR-5.08-2P]  5.63 69.74 180 top
P7  PZ254V-11-03P  [HDR-TH_3P-P2.54-V-M]  23.66 29.58 90 top
P8  4P  [SIP4]  -4.79 33.56 90 top
P9  PZ254V-11-03P  [HDR-TH_3P-P2.54-V-M]  55.05 62.78 270 top
P18  USB-B10-BRW  [USB-B-TH_USB-B12-BRW]  -18.26 4.85 270 top
P18#2  -  [USB-B-TH_USB-B10-BRW]  25.25 5.1 0 top
P19  4P  [HDR1X4_CON]  57.5 22.64 90 top
P20  PZ254V-11-03P  [HDR-TH_3P-P2.54-V-M]  55.05 55.16 270 top
R4  50K  [0603R]  37.15 44.7 90 top
R6  10K  [0603R]  40.39 15.86 270 top
R7  10K  [0603R]  -33.45 37.21 0 top
R8  10K  [0603R]  -34.85 27.73 0 top
R9  10K  [0603R]  -23.51 26.46 0 top
R10  10K  [0603R]  29.2 33.15 0 top
R11  10K  [0603R]  49.03 35.85 180 top
R12  10K  [0603R]  46.79 27.44 180 top
R13  10K  [0603R]  9 60.84 90 top
R14  47K  [0603R]  13.03 72.08 90 top
R15  10K  [0603R]  21.6 49.16 90 top
R39  100Ω  [0603R]  51.38 31.72 0 top
R40  0Ω  [0603R]  37.05 51.36 90 top
R41  0Ω  [0603R]  39.19 51.25 90 top
R42  10K  [0603R]  9.61 17.67 0 top
R43  10K  [0603R]  44.9 18.07 0 top
R44  10K  [0603R]  42.02 55.9 180 top
R45  100Ω  [0603R]  51.38 29.43 0 top
U3  1117-3.3  [SOT-223]  27.72 46.87 180 top
U5  STM32F103C8T6/CBT6  [LQFP48]  39.55 35.19 90 top
U6  XL1509-5.0E1//SXL1509-5.0E1  [ESOP-8_L4.9-W3.9-P1.27-LS6.0-BL-EP]  5.12 60.94 0 top
U12  SP3232EEN-L/TR  [SOIC-16_L9.9-W3.9-P1.27-LS6.0-BL]  31.13 59.92 0 top
U13  74LVC1G17  [SOT-23-5]  40.88 59.82 90 top
U14  74LVC1G17  [SOT-23-5]  47.1 45.59 0 top
U15  74LVC1G17  [SOT-23-5]  45.16 50.82 0 top
U17  CH340G  [SOIC-16_L9.9-W3.9-P1.27-LS6.0-BL]  24.23 16.98 0 top
Y1  12M  [晶振贴片49SSMD]  31.93 14.43 90 top
Y2  8M  [晶振贴片]  38.22 24.43 0 top

## Footprints (pads in the part's own frame, mm; a bottom-side part is the same pattern mirrored in y, then rotated)
11
  rect 0.813x0.762 smd: 1(0.043,0.296) 2(-1.524,0.301)
0603C
  rect 0.889x0.889 smd: 1(-0.774,0) 2(0.774,0)
0603LED
  rect 0.9x1 smd: 1(-0.884,-0.017) 2(0.816,-0.017)
0603R
  rect 1x1.1 smd: 1(-0.8,0) 2(0.8,0)
C1206
  rect 1.485x1.728 smd: 1(-1.593,0) 2(1.593,0)
CAP-SMD_BD5.0-L5.3-W5.3-RD
  rect 2.5x1.1 smd: 1(2.15,0) 2(-2.15,0)
CONN-TH_WJ2EDGR-5.08-2P
  round 3 hole 1.6: 1(-2.54,0) 2(2.54,0)
DB9-TH_LD09P33E4GV00LF
  rect 1.8x1.8 hole 1.1: 1(-5.54,1.42)
  round 1.8 hole 1.1: 2(-2.77,1.42) 3(0,1.42) 4(2.77,1.42) 5(5.54,1.42) 6(-4.155,-1.42) 7(-1.385,-1.42) 8(1.385,-1.42) 9(4.155,-1.42)
  round 5 hole 3.25: 10(12.5,0) 11(-12.5,0)
ESOP-8_L4.9-W3.9-P1.27-LS6.0-BL-EP
  rect 0.6x1.2 smd: 1(-1.905,-2.909) 2(-0.635,-2.909) 3(0.635,-2.909) 4(1.905,-2.909) 5(1.905,2.909) 6(0.635,2.909) 7(-0.635,2.909) 8(-1.905,2.909)
  rect 3.3x2.4 smd: 9(0,0)
HDR1X4_CON
  rect 1.5x2 hole 0.9: 1(0,0)
  oval 1.5x2 hole 0.9: 2(2.54,0) 3(5.08,0) 4(7.62,0)
HDR-TH_2P-P2.54-V-M
  rect 1.2x1.2 hole 1.2x0.8: 1(-1.27,0)
  round 1.2 hole 1.2x0.8: 2(1.27,0)
HDR-TH_3P-P2.54-V-M
  rect 1.2x1.2 hole 1.1x0.8: 1(-2.54,0)
  round 1.2 hole 1.1x0.8: 2(0,0) 3(2.54,0)
HDR-TH_5P-P2.54-V-M
  rect 1.7x1.7 hole 1.1: 1(-5.08,0)
  round 1.7 hole 1.1: 2(-2.54,0) 3(0,0) 4(2.54,0) 5(5.08,0)
IND-SMD_L7.0-W7.0_SMDRI74-330MT
  rect 2x2.2 smd: 1(-3.4,0) 2(3.4,0)
KEY-SMD_4P-L6.0-W6.0-P4.50-LS9.0
  rect 1.9x1.3 smd: 1(-4.2,2.25) 2(4.2,2.25) 3(-4.2,-2.25) 4(4.2,-2.25)
LQFP48
  oval 1.8x0.3 smd: 1(-4.3,2.75) 2(-4.3,2.25) 3(-4.3,1.75) 4(-4.3,1.25) 5(-4.3,0.75) 6(-4.3,0.25) 7(-4.3,-0.25) 8(-4.3,-0.75) 9(-4.3,-1.25) 10(-4.3,-1.75) 11(-4.3,-2.25) 12(-4.3,-2.75) 25(4.3,-2.75) 26(4.3,-2.25) 27(4.3,-1.75) 28(4.3,-1.25) 29(4.3,-0.75) 30(4.3,-0.25) 31(4.3,0.25) 32(4.3,0.75) 33(4.3,1.25) 34(4.3,1.75) 35(4.3,2.25) 36(4.3,2.75)
  oval 0.3x1.8 smd: 13(-2.75,-4.3) 14(-2.25,-4.3) 15(-1.75,-4.3) 16(-1.25,-4.3) 17(-0.75,-4.3) 18(-0.25,-4.3) 19(0.25,-4.3) 20(0.75,-4.3) 21(1.25,-4.3) 22(1.75,-4.3) 23(2.25,-4.3) 24(2.75,-4.3) 37(2.75,4.3) 38(2.25,4.3) 39(1.75,4.3) 40(1.25,4.3) 41(0.75,4.3) 42(0.25,4.3) 43(-0.25,4.3) 44(-0.75,4.3) 45(-1.25,4.3) 46(-1.75,4.3) 47(-2.25,4.3) 48(-2.75,4.3)
SIP4
  rect 1.2x1.2 hole 0.8: 1(0,0)
  round 1.2 hole 0.8: 2(2.54,0) 3(5.08,0) 4(7.62,0)
SMA
  rect 2x2 smd: 1(2.1,0) 2(-2.1,0)
SOD-123_L2.8-W1.8-LS3.7-RD
  rect 0.95x1.15 smd: 1(-1.692,0) 2(1.692,0)
SOD-323_L1.8-W1.3-LS2.5-BI
  rect 0.986x0.49 smd: 1(-1.117,0) 2(1.117,0)
SOIC-16_L9.9-W3.9-P1.27-LS6.0-BL
  oval 0.602x1.971 smd: 1(-4.445,-2.736) 2(-3.175,-2.736) 3(-1.905,-2.736) 4(-0.635,-2.736) 5(0.635,-2.736) 6(1.905,-2.736) 7(3.175,-2.736) 8(4.445,-2.736) 9(4.445,2.736) 10(3.175,2.736) 11(1.905,2.736) 12(0.635,2.736) 13(-0.635,2.736) 14(-1.905,2.736) 15(-3.175,2.736) 16(-4.445,2.736)
SOT-23-5
  rect 1.1x0.6 smd: 1(-1.4,0.95) 2(-1.4,0) 3(-1.4,-0.95) 4(1.4,-0.95) 5(1.4,0.95)
SOT-223
  rect 1.1x1.6 smd: 1(-2.3,-2.7) 2(0,-2.7) 3(2.3,-2.7)
  rect 3.6x2 smd: 4(0,2.8)
USB-B-TH_USB-B10-BRW
  round 1.6 hole 1: 1(1.25,2.355) 2(-1.25,2.355) 3(-1.25,0.355) 4(1.25,0.355)
  round 3.5 hole 2.5: 5(-6.02,-2.355) 6(6.02,-2.355)
USB-B-TH_USB-B12-BRW
  round 1.6 hole 1: 1(12.172,12.268) 2(9.672,12.268) 3(9.672,9.068) 4(12.172,9.068)
  round 3.5 hole 2.5: 5(4.902,9.768) 6(16.942,9.768)
晶振贴片
  rect 3x1.5 smd: 1(-5,0) 2(5,0)
晶振贴片49SSMD
  rect 2.5x1 smd: 1(-2.8,0) 2(2.8,0)
电解电容贴片6X6
  rect 3x1 smd: 1(-2.8,0) 2(2.8,0)

## Nets
As in the schematic, except:
GND: C8.1 C10.1 C13.2 C14.2 C15.1 C16.1 C17.1 C18.1 C19.2 C20.1 C21.1 C22.2 C23.2 C24.2 C25.2 C26.2 C29.1 C31.2 C32.1 C33.1 C34.1 C35.2 C36.2 D6.2 D11.1 D12.1 D14.2 D15.2 DB1.4 DB1.5 H1.1 H3.1 H3.2 H9.2 H10.2 K1.1 K1.2 K2.1 K2.2 K3.1 K3.2 P4.1 P5.1 P6.2 P7.1 P8.2 P9.1 P18.4 P18.5 P18.6 P18#2.4 P18#2.5 P18#2.6 P19.4 P20.1 R10.1 R11.1 R13.2 R44.1 U3.1 U5.8 U5.23 U5.35 U5.47 U6.5 U6.6 U6.7 U6.8 U12.15 U13.3 U14.3 U15.3 U17.1
USB_DM: P18.2 P18#2.2 U17.6
USB_DP: P18.3 P18#2.3 U17.5
VUSB: H11.2 P18.1 P18#2.1

Pads without a net: DB1 7 10 11; U5 1; U6 9; U12 9 10; U13 1; U14 1; U15 1; U17 9 10 11 12 14 15

## Text on the board
Top Silkscreen Layer: 5V | PWM2 | PWM3 | PWM | GND | TX1 | RX1 | TX3 | RX3 | 24V+ | TX2 | RX2
